# Altium project ADCin.PrjPcb
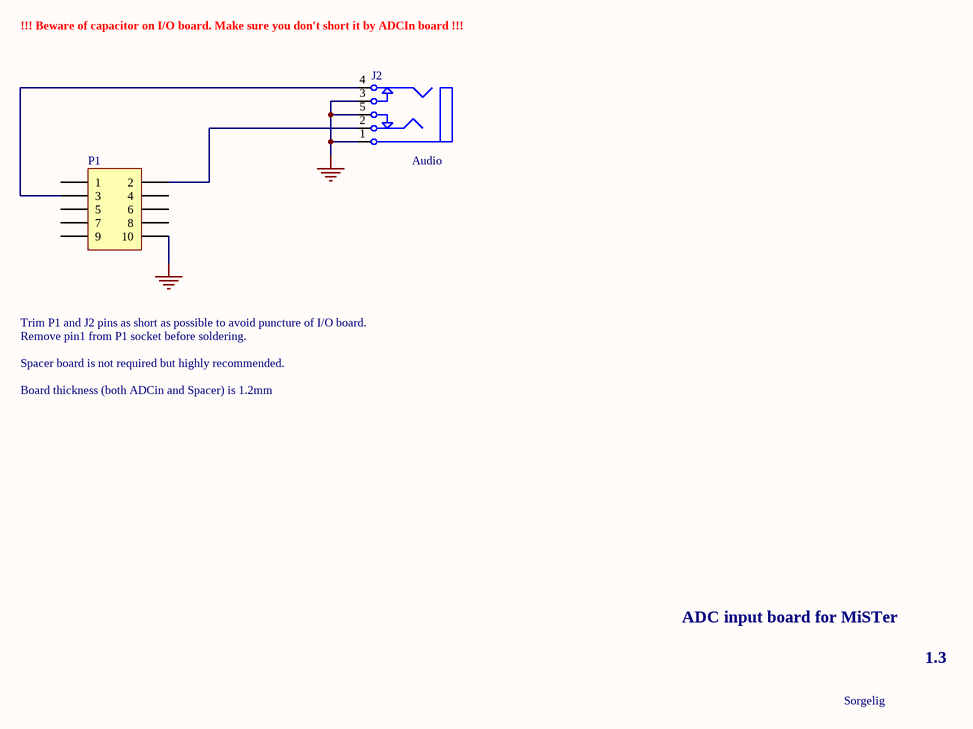
[diagram p0: ADCin.SchDoc]
1 sheet, 2 parts. Net scope: global (net labels, ports and power ports of the same name join across sheets).
Board files: ADCin.PcbDoc, ADCin_spacer.PcbDoc

## Sheet ADCin.SchDoc
size A4

### Parts
J2  Audio  [phonejack]
P1  Header 5X2  [HDR2X5]  (value not drawn)

### Nets
GND: J2.1 J2.3 J2.5 P1.10
NetJ2_2: J2.2 P1.2
NetJ2_4: J2.4 P1.3

Not connected (* = marked no-connect by the designer): P1 1 4 5 6 7 8 9

### Notes on the sheet
- !!! Beware of capacitor on I/O board. Make sure you don't short it by ADCIn board !!!
- Trim P1 and J2 pins as short as possible to avoid puncture of I/O board.
- Remove pin1 from P1 socket before soldering.
- Spacer board is not required but highly recommended.
- Board thickness (both ADCin and Spacer) is 1.2mm
- ADC input board for MiSTer
- 1.3
- Sorgelig

### Library data of the parts
J2 = phonejack
P1 = Header 5X2: Header, 5-Pin, Dual row; LatestRevisionDate: 17-Jul-2002; LatestRevisionNote: Re-released for DXP Platform.; Publisher: Altium Limited